# EAGLE design pixelAdapter_l432 (EAGLE 9.6.2)
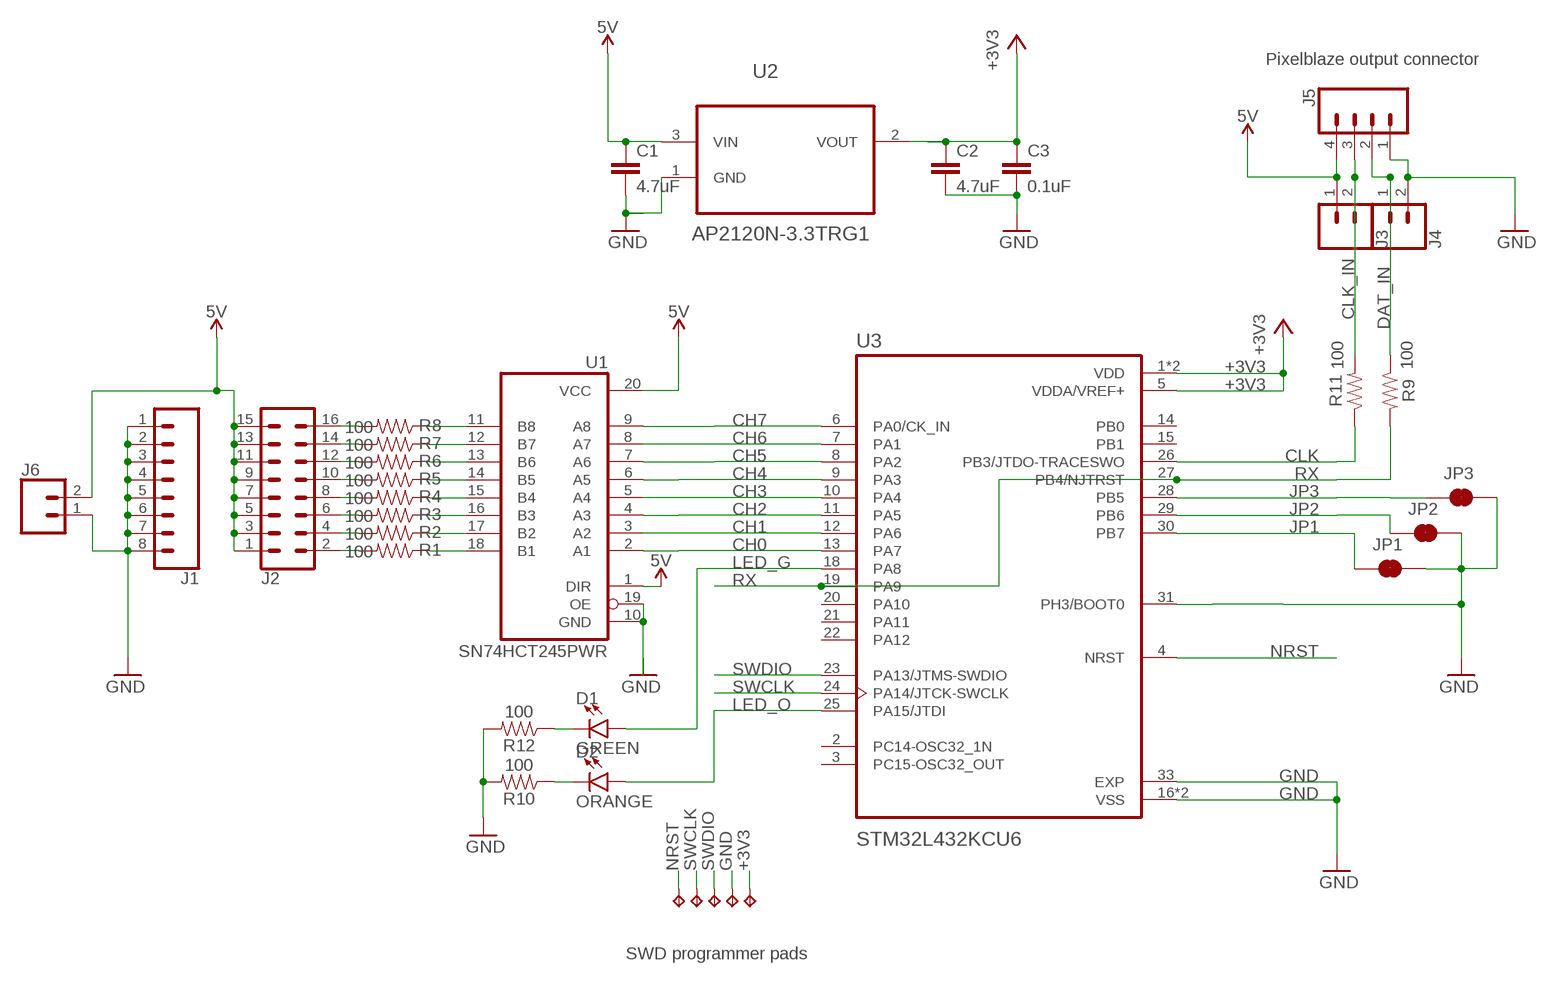
[diagram p0: schematic, sheet 1]

## Parts
C1  4.7uF  4.7UF0603  [0603]
C2  4.7uF  4.7UF0603  [0603]
C3  0.1uF  0.1UF-0603-25V-(+80/-20%)  [0603]
D1  GREEN  LED0603  [LED-0603]
D2  ORANGE  LED0603  [LED-0603]
J1  CONN_08NO_SILK_FEMALE_PTH  [1X08_NO_SILK]
J2  CONN_08X2NOSILK  [2X8-NOSILK]
J3  CONN_025MM  [SCREWTERMINAL-5MM-2]
J4  CONN_025MM  [SCREWTERMINAL-5MM-2]
J5  CONN_04LOCK  [1X04_LOCK]
J6  CONN_02  [1X02]
JP1  JUMPER-SMT_2_NC_TRACE_SILK  [SMT-JUMPER_2_NC_TRACE_SILK]
JP2  JUMPER-SMT_2_NC_TRACE_SILK  [SMT-JUMPER_2_NC_TRACE_SILK]
JP3  JUMPER-SMT_2_NC_TRACE_SILK  [SMT-JUMPER_2_NC_TRACE_SILK]
R1  100  100OHM-0603-1/10W-1%  [0603]
R2  100  100OHM-0603-1/10W-1%  [0603]
R3  100  100OHM-0603-1/10W-1%  [0603]
R4  100  100OHM-0603-1/10W-1%  [0603]
R5  100  100OHM-0603-1/10W-1%  [0603]
R6  100  100OHM-0603-1/10W-1%  [0603]
R7  100  100OHM-0603-1/10W-1%  [0603]
R8  100  100OHM-0603-1/10W-1%  [0603]
R9  100  100OHM-0603-1/10W-1%  [0603]
R10  100  100OHM-0603-1/10W-1%  [0603]
R11  100  100OHM-0603-1/10W-1%  [0603]
R12  100  100OHM-0603-1/10W-1%  [0603]
TP1  TPTP20SQ  [TP20SQ]
TP2  TPTP20SQ  [TP20SQ]
TP3  TPTP20SQ  [TP20SQ]
TP4  TPTP20SQ  [TP20SQ]
TP5  TPTP20SQ  [TP20SQ]
U1  SN74HCT245PWR  74245PW  [TSSOP20]
U2  AP2120N-3.3TRG1  MCP1700T-3302E/TT  [SOT95P237X112-3N]
U3  STM32L432KCU6  [QFN50P500X500X60-33N]

## Nets
5V: C1.1 J2.1 J2.3 J2.5 J2.7 J2.9 J2.11 J2.13 J2.15 J3.1 J5.4 J6.2 U1.1(DIR) U1.20(VCC) U2.3(VIN)
+3V3: C2.1 C3.1 TP4.TP U2.2(VOUT) U3.1(VDD) U3.5(VDDA/VREF+) U3.17(VDD)
CH0: U1.2(A1) U3.13(PA7)
CH1: U1.3(A2) U3.12(PA6)
CH2: U1.4(A3) U3.11(PA5)
CH3: U1.5(A4) U3.10(PA4)
CH4: U1.6(A5) U3.9(PA3)
CH5: U1.7(A6) U3.8(PA2)
CH6: U1.8(A7) U3.7(PA1)
CH7: U1.9(A8) U3.6(PA0/CK_IN)
CLK: R11.1 U3.26(PB3/JTDO-TRACESWO)
CLK_IN: J3.2 J5.3 R11.2
DAT_IN: J4.1 J5.2 R9.1
GND: C1.2 C2.2 C3.2 J1.1 J1.2 J1.3 J1.4 J1.5 J1.6 J1.7 J1.8 J4.2 J5.1 J6.1 JP1.2 JP2.2 JP3.1 R10.2 R12.2 TP3.TP U1.10(GND) U1.19(OE) U2.1(GND) U3.16(VSS) U3.31(PH3/BOOT0) U3.32(VSS) U3.33(EXP)
JP1: JP1.1 U3.30(PB7)
JP2: JP2.1 U3.29(PB6)
JP3: JP3.2 U3.28(PB5)
LED0: J2.2 R1.2
LED1: J2.4 R2.2
LED2: J2.6 R3.2
LED3: J2.8 R4.2
LED4: J2.10 R5.2
LED5: J2.12 R6.2
LED6: J2.14 R7.2
LED7: J2.16 R8.2
LED_G: D1.A U3.18(PA8)
LED_O: D2.A U3.25(PA15/JTDI)
N$2: D1.C R12.1
N$12: R1.1 U1.18(B1)
N$13: R2.1 U1.17(B2)
N$14: R3.1 U1.16(B3)
N$15: R4.1 U1.15(B4)
N$16: R5.1 U1.14(B5)
N$17: R6.1 U1.13(B6)
N$18: R7.1 U1.12(B7)
N$19: R8.1 U1.11(B8)
N$21: D2.C R10.1
NRST: TP5.TP U3.4(NRST)
RX: R9.2 U3.19(PA9) U3.27(PB4/NJTRST)
SWCLK: TP1.TP U3.24(PA14/JTCK-SWCLK)
SWDIO: TP2.TP U3.23(PA13/JTMS-SWDIO)
Unconnected: U3.2(PC14-OSC32_1N) U3.3(PC15-OSC32_OUT) U3.14(PB0) U3.15(PB1) U3.20(PA10) U3.21(PA11) U3.22(PA12)

## Notes on the sheet
- Pixelblaze output connector
- SWD programmer pads

## Library data of the parts
C1 C2 = SparkFun-Capacitors:4.7UF: 4.7µF ceramic capacitors A capacitor is a passive two-terminal electrical component used to store electrical energy temporarily in an electric field.; PROD_ID: CAP-08280
C3 = SparkFun-Capacitors:0.1UF: 0.1µF ceramic capacitors A capacitor is a passive two-terminal electrical component used to store electrical energy temporarily in an electric field.; PROD_ID: CAP-00810
D1 D2 = SparkFun-LED:LED: LED (Generic) Standard schematic elements and footprints for 5mm, 3mm, 1206, and 0603 sized LEDs. Generic LEDs with no color specified.
J1 = SparkFun-Connectors:CONN_08: Multi connection point. Often used as Generic Header-pin footprint for 0.1 inch spaced/style header connections On any of the 0.1 inch spaced packages, you can populate with these: Break Away Headers - Straight <https://www.sparkfun.com/products/116> (PRT-00116) Break Away Male Headers - Right Angle <https://www.sparkfun.com/products/553> (PRT-00553) Female Headers <https://www.sparkfun.com/products/115> (PRT-00115) Break Away Headers - Machine Pin <https://www.sparkfun.com/products/117> (PRT-00117) Break Away Female Headers - Swiss Machine Pin <https://www.sparkfun.com/products/743> (PRT-00743) Arduino Stackable Header - 8 Pin <https://www.sparkfun.com/products/9279> (PRT-09279) For SCREWTERMINALS and SPRING TERMINALS visit here: Screw Terimnals on SparkFun.com <https://www.sparkfun.com/search/results?term=Screw+Terminals> (5mm/3.5mm/2.54mm spacing) This device is also useful as a general connection point to wire up your design to another part of your project. Our various solder wires solder well into these plated through hole pads. Hook-Up Wire - Assortment (Stranded, 22 AWG) <https://www.sparkfun.com/products/11375> (PRT-11375) Hook-Up Wire - Assortment (Solid Core, 22 AWG) <https://www.sparkfun.com/products/11367> (PRT-11367) View the entire wire category on our website here <https://www.sparkfun.com/categories/141> Special notes: Molex polarized connector foot print use with SKU : PRT-08231 with associated crimp pins and housings. 1MM SMD Version SKU: PRT-10208 NOTES ON THE VARIANTS LOCK and LOCK_LONGPADS... This footprint was designed to help hold the alignment of a through-hole component (i.e. 6-pin header) while soldering it into place. You may notice that each hole has been shifted either up or down by 0.005 of an inch from it's more standard position (which is a perfectly straight line). This slight alteration caused the pins (the squares in the middle) to touch the edges of the holes. Because they are alternating, it causes a "brace" to hold the component in place. 0.005 has proven to be the perfect amount of "off-center" position when using our standard breakaway headers. Although looks a little odd when you look at the bare footprint, once you have a header in there, the alteration is very hard to notice. Also,if you push a header all the way into place, it is covered up entirely on the bottom side.; PROD_ID: CONN-08438
J2 = bens:CONN_08X2: Multi connection point. Often used as Generic Header-pin footprint for 0.1 inch spaced/style header connections You can populate with any combo of single row headers, but if you'd like an exact match, check this: Header - 2x8 (Male, 0.1") <https://www.sparkfun.com/products/13156> (PRT-13156) On any of the 0.1 inch spaced packages, you can populate with these: Break Away Headers - Straight <https://www.sparkfun.com/products/116> (PRT-00116) Break Away Male Headers - Right Angle <https://www.sparkfun.com/products/553> (PRT-00553) Female Headers <https://www.sparkfun.com/products/115> (PRT-00115) Break Away Headers - Machine Pin <https://www.sparkfun.com/products/117> (PRT-00117) Break Away Female Headers - Swiss Machine Pin <https://www.sparkfun.com/products/743> (PRT-00743)
J3 J4 = bens:CONN_02: Multi connection point. Often used as Generic Header-pin footprint for 0.1 inch spaced/style header connections On any of the 0.1 inch spaced packages, you can populate with these: Break Away Headers - Straight <https://www.sparkfun.com/products/116> (PRT-00116) Break Away Male Headers - Right Angle <https://www.sparkfun.com/products/553> (PRT-00553) Female Headers <https://www.sparkfun.com/products/115> (PRT-00115) Break Away Headers - Machine Pin <https://www.sparkfun.com/products/117> (PRT-00117) Break Away Female Headers - Swiss Machine Pin <https://www.sparkfun.com/products/743> (PRT-00743) For SCREWTERMINALS and SPRING TERMINALS visit here: Screw Terimnals on SparkFun.com <https://www.sparkfun.com/search/results?term=Screw+Terminals> (5mm/3.5mm/2.54mm spacing) This device is also useful as a general connection point to wire up your design to another part of your project. Our various solder wires solder well into these plated through hole pads. Hook-Up Wire - Assortment (Stranded, 22 AWG) <https://www.sparkfun.com/products/11375> (PRT-11375) Hook-Up Wire - Assortment (Solid Core, 22 AWG) <https://www.sparkfun.com/products/11367> (PRT-11367) View the entire wire category on our website here <https://www.sparkfun.com/categories/141> Special notes: Molex polarized connector foot print use with: PRT-08233 with associated crimp pins and housings. 2.54_SCREWTERM for use with PRT-10571. 3.5mm Screw Terminal footprints for PRT-08084 5mm Screw Terminal footprints for use with PRT-08432; SF_SKU: PRT-08432
J5 = SparkFun-Connectors:CONN_04: Multi connection point. Often used as Generic Header-pin footprint for 0.1 inch spaced/style header connections On any of the 0.1 inch spaced packages, you can populate with these: Break Away Headers - Straight <https://www.sparkfun.com/products/116> (PRT-00116) Break Away Male Headers - Right Angle <https://www.sparkfun.com/products/553> (PRT-00553) Female Headers <https://www.sparkfun.com/products/115> (PRT-00115) Break Away Headers - Machine Pin <https://www.sparkfun.com/products/117> (PRT-00117) Break Away Female Headers - Swiss Machine Pin <https://www.sparkfun.com/products/743> (PRT-00743) For SCREWTERMINALS and SPRING TERMINALS visit here: Screw Terimnals on SparkFun.com <https://www.sparkfun.com/search/results?term=Screw+Terminals> (5mm/3.5mm/2.54mm spacing) This device is also useful as a general connection point to wire up your design to another part of your project. Our various solder wires solder well into these plated through hole pads. Hook-Up Wire - Assortment (Stranded, 22 AWG) <https://www.sparkfun.com/products/11375> (PRT-11375) Hook-Up Wire - Assortment (Solid Core, 22 AWG) <https://www.sparkfun.com/products/11367> (PRT-11367) View the entire wire category on our website here <https://www.sparkfun.com/categories/141> Special notes: Molex polarized connector foot print use with SKU : PRT-08231 with associated crimp pins and housings. 1MM SMD Version SKU: PRT-10208; PROD_ID: CONN-09696
J6 = SparkFun-Connectors:CONN_02: Multi connection point. Often used as Generic Header-pin footprint for 0.1 inch spaced/style header connections On any of the 0.1 inch spaced packages, you can populate with these: Break Away Headers - Straight <https://www.sparkfun.com/products/116> (PRT-00116) Break Away Male Headers - Right Angle <https://www.sparkfun.com/products/553> (PRT-00553) Female Headers <https://www.sparkfun.com/products/115> (PRT-00115) Break Away Headers - Machine Pin <https://www.sparkfun.com/products/117> (PRT-00117) Break Away Female Headers - Swiss Machine Pin <https://www.sparkfun.com/products/743> (PRT-00743) For SCREWTERMINALS and SPRING TERMINALS visit here: Screw Terimnals on SparkFun.com <https://www.sparkfun.com/search/results?term=Screw+Terminals> (5mm/3.5mm/2.54mm spacing) This device is also useful as a general connection point to wire up your design to another part of your project. Our various solder wires solder well into these plated through hole pads. Hook-Up Wire - Assortment (Stranded, 22 AWG) <https://www.sparkfun.com/products/11375> (PRT-11375) Hook-Up Wire - Assortment (Solid Core, 22 AWG) <https://www.sparkfun.com/products/11367> (PRT-11367) View the entire wire category on our website here <https://www.sparkfun.com/categories/141> Special notes: Molex polarized connector foot print use with: PRT-08233 with associated crimp pins and housings. 2.54_SCREWTERM for use with PRT-10571. 3.5mm Screw Terminal footprints for PRT-08084 5mm Screw Terminal footprints for use with PRT-08432
JP1-JP3 = SparkFun-Jumpers:JUMPER-SMT_2_NC_TRACE: Normally closed trace jumper This jumper has a trace between two pads so it's normally closed (NC). Use a razor knife to open the connection. For best results follow the IPC guidelines for cutting traces: Cutout at least 0.063 mm (0.005 in). Remove all loose material to clean up the cut area. Seal the cut with an approved epoxy. Reapply solder to reclose the connection.
R1-R12 = SparkFun-Resistors:100OHM: 100Ω resistor A resistor is a passive two-terminal electrical component that implements electrical resistance as a circuit element. Resistors act to reduce current flow, and, at the same time, act to lower voltage levels within circuits. - Wikipedia; PROD_ID: RES-07863
TP1-TP5 = testpad:TP: Test pad
U1 = scanlime:74*245: Octal BUS TRANSCEIVER, 3-state
U2 = Microchip_By_element14_Batch_1:MCP1700T-3302E/TT: Low Quiescent Current LDO; MPN: MCP1700T-3302E/TT; OC_FARNELL: 1296592; OC_NEWARK: 88H9817; PACKAGE: SOT23-3; SUPPLIER: Microchip
U3 = STM32L432KCU6:STM32L432KCU6: None Check prices <https://pricing.snapeda.com/parts/STM32L432KCU6/STMicroelectronics/view-part?ref=eda>; AVAILABILITY: Good; DESCRIPTION: ARM® Cortex®-M4 STM32L4 Microcontroller IC 32-Bit 80MHz 256KB (256K x 8) FLASH 32-UFQFPN (5x5); MF: STMicroelectronics; MP: STM32L432KCU6; PACKAGE: UFQFN-32 STMicroelectronics; PRICE: None; PURCHASE-URL: https://pricing.snapeda.com/search/part/STM32L432KCU6/?ref=eda

## Board
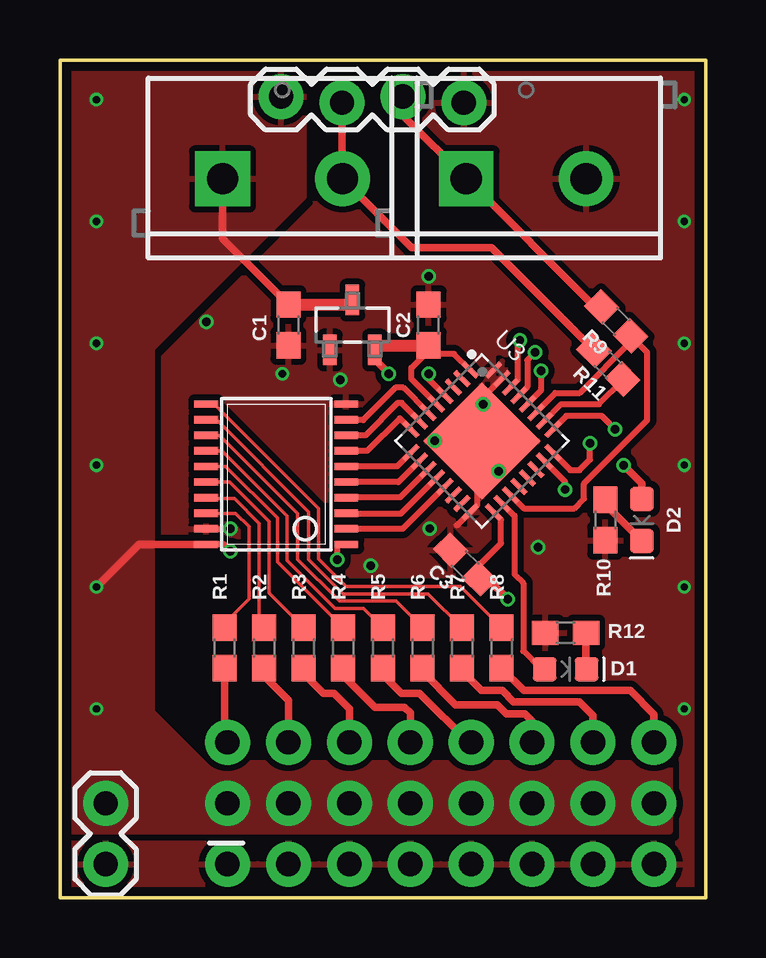
[diagram p1: board, top side]
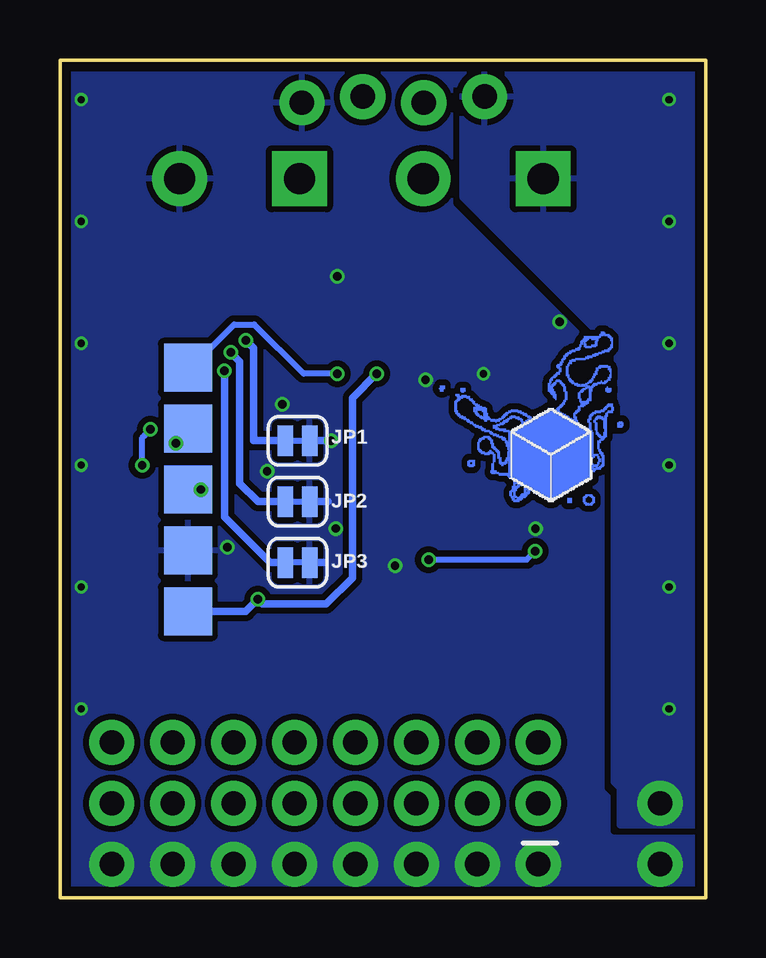
[diagram p2: board, bottom side, seen from below]

Size 26.92 x 34.92 mm. Coordinates in mm from the lower left corner, seen from the top.
Outline: 0,0 26.92,0 26.92,34.92 0,34.92 0,0
Copper layers (1*16): Top 0.035559375mm / dielectric 1.6mm / Bottom 0.035559375mm
Design rules "oshpark-2layer-benmod": minimum track width 6mil, minimum drill 10mil, track to track 6mil, track to pad 6mil, pad to pad 6mil, via to via 6mil, smd to smd 6mil, copper to edge 15mil, drill to drill 6mil, minimum pad ring 5mil, minimum via ring 5mil, stop-mask expansion 1mil, vias tented up to drill 20mil, thermal gap 10mil

### Footprints (pad centres in the part's own frame; a part is rotated, then mirrored left to right if it is on the bottom)
0603 = smd 1.1 x 1: 1 -0.85,0; 2 0.85,0
LED-0603 = smd 1 x 1: A -0.877,0; C 0.877,0
1X08_NO_SILK = drill 1.016 pad 1.88: 1 0,0; 2 2.54,0; 3 5.08,0; 4 7.62,0; 5 10.16,0; 6 12.7,0; 7 15.24,0; 8 17.78,0
2X8-NOSILK = drill 1.016 pad 1.88: 1 0,0; 2 0,2.54; 3 2.54,0; 4 2.54,2.54; 5 5.08,0; 6 5.08,2.54; 7 7.62,0; 8 7.62,2.54; 9 10.16,0; 10 10.16,2.54; 11 12.7,0; 12 12.7,2.54; 13 15.24,0; 14 15.24,2.54; 15 17.78,0; 16 17.78,2.54
SCREWTERMINAL-5MM-2 = drill 1.3 pad 2.286 square: 1 0,0 | drill 1.3 pad 2.286: 2 5,0
1X04_LOCK = drill 1.016 pad 1.88: 1 0,0.127; 2 2.54,-0.127; 3 5.08,0.127; 4 7.62,-0.127
1X02 = drill 1.016 pad 1.88: 1 0,0; 2 2.54,0
SMT-JUMPER_2_NC_TRACE_SILK = smd 0.635 x 1.27: 1 -0.508,0; 2 0.508,0
TP20SQ = smd 2 x 2: TP 0,0
TSSOP20 = smd 0.305 x 0.991: 1 -2.925,-2.918; 2 -2.275,-2.918; 3 -1.625,-2.918; 4 -0.975,-2.918; 5 -0.325,-2.918; 6 0.325,-2.918; 7 0.975,-2.918; 8 1.625,-2.918; 9 2.275,-2.918; 10 2.925,-2.918; 11 2.925,2.918; 12 2.275,2.918; 13 1.625,2.918; 14 0.975,2.918; 15 0.325,2.918; 16 -0.325,2.918; 17 -0.975,2.918; 18 -1.625,2.918; 19 -2.275,2.918; 20 -2.925,2.918
SOT95P237X112-3N = smd 0.559 x 1.27: 1 -0.94,-1.041; 2 0.94,-1.041; 3 0,1.041
QFN50P500X500X60-33N = smd 0.86 x 0.25: 1 -2.435,1.75; 2 -2.435,1.25; 3 -2.435,0.75; 4 -2.435,0.25; 5 -2.435,-0.25; 6 -2.435,-0.75; 7 -2.435,-1.25; 8 -2.435,-1.75; 17 2.435,-1.75; 18 2.435,-1.25; 19 2.435,-0.75; 20 2.435,-0.25; 21 2.435,0.25; 22 2.435,0.75; 23 2.435,1.25; 24 2.435,1.75 | smd 0.25 x 0.86: 9 -1.75,-2.435; 10 -1.25,-2.435; 11 -0.75,-2.435; 12 -0.25,-2.435; 13 0.25,-2.435; 14 0.75,-2.435; 15 1.25,-2.435; 16 1.75,-2.435; 25 1.75,2.435; 26 1.25,2.435; 27 0.75,2.435; 28 0.25,2.435; 29 -0.25,2.435; 30 -0.75,2.435; 31 -1.25,2.435; 32 -1.75,2.435 | smd 3.45 x 3.45: 33 0,0

### Placement (x,y rotation side)
C1  9.53,23.88 270 top
C2  15.37,23.88 90 top
C3  16.89,13.89 135 top
D1  21.08,9.53 0 top
D2  24.26,15.75 270 top
J1  6.99,1.4 0 top
J2  6.99,3.94 0 top
J3  6.78,29.97 0 top
J4  16.94,29.97 0 top
J5  16.84,33.27 180 top
J6  1.91,1.4 90 top
JP1  17.02,19.05 0 bottom
JP2  17.02,16.51 0 bottom
JP3  17.02,13.97 180 bottom
R1  6.86,10.41 270 top
R2  8.51,10.41 270 top
R3  10.16,10.41 270 top
R4  11.81,10.41 270 top
R5  13.46,10.41 270 top
R6  15.11,10.41 270 top
R7  16.76,10.41 270 top
R8  18.41,10.41 270 top
R9  23.19,24.03 315 top
R10  22.73,15.75 270 top
R11  22.86,22.23 135 top
R12  21.08,11.05 180 top
TP1  21.59,19.56 0 bottom
TP2  21.59,17.02 0 bottom
TP3  21.59,14.48 0 bottom
TP4  21.59,11.94 0 bottom
TP5  21.59,22.1 180 bottom
U1  9.02,17.65 90 top
U2  12.19,23.88 0 top
U3  17.59,19.04 315 top
U$2  [ELECTRO_MAGE_PCB4_PIXEL_2#PNG]  7.28,20 0 bottom

### Tracks (layer width: path | path; a pad name or v marks a point on that pad's centre or on a via)
5V  (via drill 0.3, 0.35)
  Top 0.254: U1.1 11.68,14.73 11.56,14.61 v11.56,14.1 | v7.11,14.45 6.83,14.73 U1.20
  Top 0.305: 12,24.73 U2.3 | C1.1 6.78,27.47 J3.1 | v1.52,12.95 3.3,14.73 U1.20
  Top 0.508: C1.1 12,24.73
  Bottom 0.254: v7.11,14.45 7.46,14.1 v11.56,14.1
  other vias: 1.52,7.87 1.52,18.03 1.52,23.11 1.52,28.19 1.52,33.27
  pour Top (isolate 0.254, no thermals): 25.4,5.59 25.4,2.79 0,2.79 0,25.4 3.81,25.4 3.81,7.75 5.97,5.59
  pour Top (isolate 0.254): 10.16,34.8 10.16,29.21 3.81,22.86 0,22.86 0,34.8
  pour Bottom (isolate 0.254): 10.16,34.8 10.16,29.21 3.81,22.86 0,22.86 0,34.8
  pour Bottom (isolate 0.254, no thermals): 3.81,4.83 3.56,4.57 3.56,3.05 0,3.05 0,25.4 3.81,25.4
+3V3  (via drill 0.35)
  Top 0.254: U3.1 16.44,22.67 15.72,22.67 C2.1 15.37,22.8 14.66,22.09 14.66,21.62 U3.5 | U3.17 18.39,15.77 18.39,14.78 17.49,13.88 C3.1
  Top 0.305: U2.2 13.13,22.43 v13.72,21.84 | C3.1 17.82,13.29 v18.67,12.45
  Top 0.508: U2.2 13.32,23.03 C2.1
  Bottom 0.305: v13.72,21.84 14.73,20.83 14.73,13.34 15.82,12.24 18.47,12.24 v18.67,12.45 19.18,11.94 TP4.TP
CH0
  Top 0.254: U1.2 14.29,15.38 U3.13
CH1
  Top 0.254: U3.12 14.2,16 11.96,16 U1.3
CH2
  Top 0.254: U3.11 14.18,16.69 11.95,16.69 U1.4
CH3
  Top 0.254: U3.10 14.11,17.33 U1.5
CH4
  Top 0.254: U3.9 14.06,17.98 U1.6
CH5
  Top 0.254: U3.8 14.17,19.99 12.81,18.63 U1.7
CH6
  Top 0.254: U3.7 14.24,20.62 14.08,20.62 12.73,19.27 U1.8
CH7
  Top 0.254: U3.6 14.31,21.26 13.99,21.26 12.64,19.91 11.95,19.91 U1.9
CLK
  Top 0.254: U3.26 20.89,20.57 22.48,20.57 23.46,21.56 R11.1
CLK_IN
  Top 0.305: J5.3 11.76,29.99 J3.2 14.65,27.1 17.98,27.1 R11.2
DAT_IN
  Top 0.305: J5.2 14.3,32.61 J4.1 16.97,29.97 22.31,24.63 R9.1
GND  (via drill 0.3, 0.35)
  Top 0.254: U1.19 v7.1,15.38 | U3.31 17.65,20.87 v17.65,20.57 | U3.33 17.4,18.85 17.4,16.37 U3.16 16.55,15.52
  Bottom 0.305: JP1.2 v15.62,19.05 | JP3.1 15.88,13.97 | JP2.2 15.75,16.51
  other vias: 26.04,12.95 9.27,21.84 6.1,24 18.29,17.78 19.94,14.61 11.68,21.59 15.37,25.91 15.42,15.39 12.95,13.84 26.04,18.03 26.04,23.11 26.04,28.19 26.04,33.27 26.04,7.87
  pour Top (isolate 0.254, rank 6): 0,34.8 26.92,34.8 26.92,0 0,0
  pour Bottom (isolate 0.254, rank 6): 0,34.8 26.92,34.8 26.92,0 0,0
  pour Bottom (isolate 0.254, rank 6, no thermals): 0,2.79 26.67,2.79 26.67,0 0,0
JP1  (via drill 0.35)
  Top 0.254: U3.30 19.08,21.59 19.08,23.11 19.18,23.21 v19.18,23.24
  Bottom 0.305: JP1.1 18.85,19.05 18.85,22.91 v19.18,23.24
JP2  (via drill 0.35)
  Top 0.254: U3.29 19.48,21.29 19.48,22.41 v19.81,22.73
  Bottom 0.305: JP2.1 18.67,16.51 19.43,17.27 19.43,22.36 v19.81,22.73
JP3  (via drill 0.35)
  Top 0.254: U3.28 20.07,21.16 v20.07,21.97
  Bottom 0.305: JP3.2 18.16,13.97 20.07,15.88 v20.07,21.97
LED0
  Top 0.305: J2.2 6.86,6.6 R1.2
LED1
  Top 0.305: R2.2 8.51,9.25 9.53,8.23 J2.4
LED2
  Top 0.305: R3.2 10.16,9.35 11,8.51 11.43,8.51 12.06,7.87 J2.6
LED3
  Top 0.305: R4.2 11.81,9.27 13.14,7.94 14.36,7.94 14.61,7.7 J2.8
LED4
  Top 0.305: R5.2 13.46,9.3 14.24,8.52 15,8.52 17.04,6.48 J2.10
LED5
  Top 0.305: J2.12 19.68,7.37 19.38,7.67 18.61,7.67 18.23,8.05 16.49,8.05 15.11,9.43 R6.2
LED6
  Top 0.305: J2.14 22.23,7.59 21.65,8.17 18.91,8.17 18.44,8.64 17.58,8.64 16.76,9.46 R7.2
LED7
  Top 0.305: R8.2 19.34,8.64 23.78,8.64 24.77,7.65 J2.16
LED_G
  Top 0.254: U3.18 18.95,15.92 18.95,13.49 19.32,13.12 19.32,10.29 20.08,9.53 D1.A
LED_O  (via drill 0.35)
  Top 0.254: v23.15,19.52 22.59,20.08 21.11,20.08 U3.25
  Top 0.305: D2.A 24.26,17.27 v23.5,18.03
  Bottom 0.254: v23.5,18.03 23.5,19.18 23.4,19.27 v23.15,19.52
N$2
  Top 0.305: R12.1 21.93,9.55 D1.C
N$12
  Top 0.152: R1.1 6.86,11.43 7.89,12.46 7.89,15.47 7.33,16.03 U1.18
N$13
  Top 0.152: R2.1 8.31,11.47 8.31,15.61 7.28,16.64 6.14,16.64 U1.17
N$14
  Top 0.152: R3.1 8.71,12.71 8.71,15.68 7.07,17.33 U1.16
N$15
  Top 0.152: R4.1 9.07,14.01 9.07,15.82 6.91,17.98 U1.15
N$16
  Top 0.152: R5.1 12.66,12.06 11.47,12.06 9.47,14.06 9.47,15.92 6.77,18.63 U1.14
N$17
  Top 0.152: R6.1 14.01,12.37 11.65,12.37 9.91,14.11 9.91,16.02 6.65,19.28 U1.13
N$18
  Top 0.152: R7.1 15.35,12.68 11.8,12.68 10.36,14.11 10.36,16.09 6.52,19.93 U1.12
N$19
  Top 0.152: R8.1 16.7,12.98 11.92,12.98 10.77,14.13 10.77,16.23 6.42,20.58 U1.11
N$21
  Top 0.305: D2.C 22.73,16.39 R10.1
NRST  (via drill 0.35)
  Top 0.254: U3.4 15.37,21.62 v15.37,21.84
  Bottom 0.254: TP5.TP 21.46,22.1 19.66,23.9 18.82,23.9 16.76,21.84 v15.37,21.84
RX
  Top 0.254: U3.27 20.66,21.04 21.67,21.04 23.79,23.16 R9.2 24.48,22.74 24.48,19.91 21.84,17.27 21.84,16.64 21.44,16.23 19.34,16.23 U3.19
SWCLK  (via drill 0.35)
  Top 0.254: U3.24 21.28,17.83 21.67,17.83 22.1,18.26 v22.1,18.95
  Bottom 0.152: v22.1,18.95 21.59,19.46 TP1.TP
SWDIO  (via drill 0.35)
  Top 0.254: U3.23 21.06,17.35 v21.06,17.02
  Bottom 0.152: v21.06,17.02 TP2.TP

### Text on the board
_tNames: Input | v3.0 ©2021 Ben Hencke | Output Expander | 5V | CLK | DAT | GND | Status | Draw | 0 | 1 | 2 | 3 | 4 | 5 | 6 | 7 | Data | 5V | GND
_bNames: Input | 5V | CLK | DAT | GND | Programming Pins | R | Address / Setting | C | JP1 | D | JP2 | G | JP3 | 3V | electromage.com / Output Expander / v3.0 ©2021 / Ben Hencke | 0 | 1 | 2 | 3 | 4 | 5 | 6 | 7 | Data | 5V | GND